# EAGLE design MAX5214 (EAGLE 6.5.0)

## Sheet 1 of 2

## Sheet 2 of 2
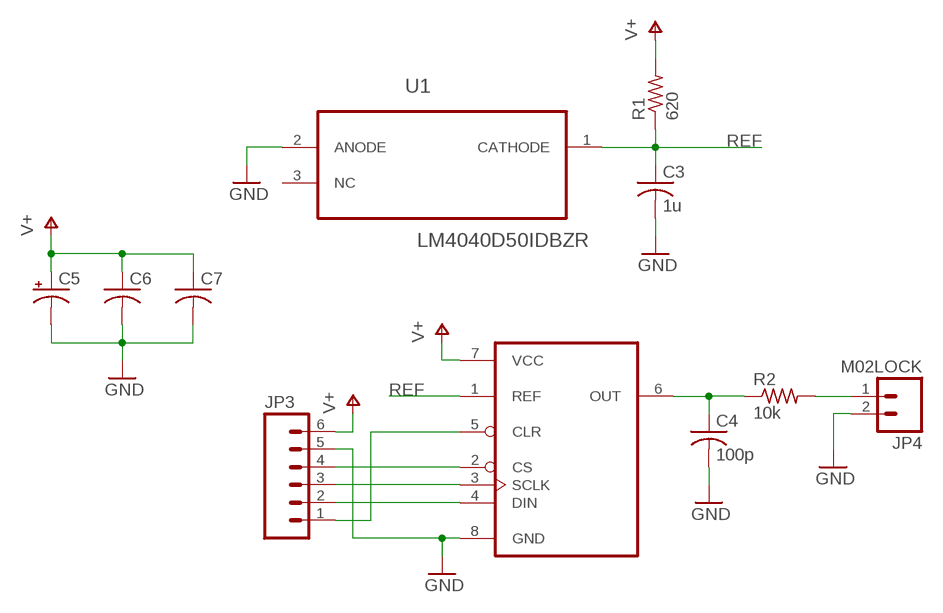
[diagram p0: schematic, sheet 2]

### Parts
C3  1u  C-USC0805  [C0805]
C4  100p  C-USC0805  [C0805]
C5  CPOL-US  [SMD_6.6X6.6]
C6  C-USC0805  [C0805]
C7  C-USC0805  [C0805]
JP3  M06LOCK  [1X06_LOCK]
JP4  M02LOCK  [1X02_LOCK]
R1  620  R-US_R0805  [R0805]
R2  10k  R-US_R0805  [R0805]
U1  LM4040D50IDBZR  [SOT95P237X112-3N]
U$2  MAX5214  [UMAX8]

### Nets
CLR: JP3.1 U$2.5(CLR)
CS: JP3.4 U$2.2(CS)
DIN: JP3.2 U$2.4(DIN)
GND: C3.2 C4.2 C5.- C6.2 C7.2 JP3.5 JP4.2 U1.2(ANODE) U$2.8(GND)
N$5: JP4.1 R2.2
N$6: C4.1 R2.1 U$2.6(OUT)
REF: C3.1 R1.1 U1.1(CATHODE) U$2.1(REF)
SCLK: JP3.3 U$2.3(SCLK)
V+: C5.+ C6.1 C7.1 JP3.6 R1.2 U$2.7(VCC)
Unconnected: U1.3(NC)

## Library data of the parts
C3 C4 C6 C7 = rcl:C-US: CAPACITOR, American symbol
C5 = rcl:CPOL-US: POLARIZED CAPACITOR, American symbol
JP3 = SparkFun-Connectors:M06: Header 6 Standard 6-pin 0.1" header. Use with straight break away headers (SKU : PRT-00116), right angle break away headers (PRT-00553), swiss pins (PRT-00743), machine pins (PRT-00117), and female headers (PRT-00115). Molex polarized connector foot print use with SKU : PRT-08094 with associated crimp pins and housings. NOTES ON THE VARIANTS LOCK and LOCK_LONGPADS... This footprint was designed to help hold the alignment of a through-hole component (i.e. 6-pin header) while soldering it into place. You may notice that each hole has been shifted either up or down by 0.005 of an inch from it's more standard position (which is a perfectly straight line). This slight alteration caused the pins (the squares in the middle) to touch the edges of the holes. Because they are alternating, it causes a "brace" to hold the component in place. 0.005 has proven to be the perfect amount of "off-center" position when using our standard breakaway headers. Although looks a little odd when you look at the bare footprint, once you have a header in there, the alteration is very hard to notice. Also,if you push a header all the way into place, it is covered up entirely on the bottom side. This idea of altering the position of holes to aid alignment will be further integrated into the Sparkfun Library for other footprints. It can help hold any component with 3 or more connection pins.
JP4 = SparkFun-Connectors:M02: Standard 2-pin 0.1" header. Use with - straight break away headers ( PRT-00116) - right angle break away headers (PRT-00553) - swiss pins (PRT-00743) - machine pins (PRT-00117) - female headers (PRT-00115) Molex polarized connector foot print use with: PRT-08233 with associated crimp pins and housings. 2.54_SCREWTERM for use with PRT-10571. 3.5mm Screw Terminal footprints for PRT-08084 5mm Screw Terminal footprints for use with PRT-08432
R1 R2 = rcl:R-US_: RESISTOR, American symbol
U1 = LM4040-5.0_SOIC:LM4040D50IDBZR: PRECISION MICROPOWER SHUNT VOLTAGE REFERENCE; MPN: LM4040D50IDBZR; OC_FARNELL: 1652239; OC_NEWARK: 43K3367; PACKAGE: 3-SOT-23; SUPPLIER: TEXAS INSTRUMENTS
U$2 = maxim:MAX5214

## Board
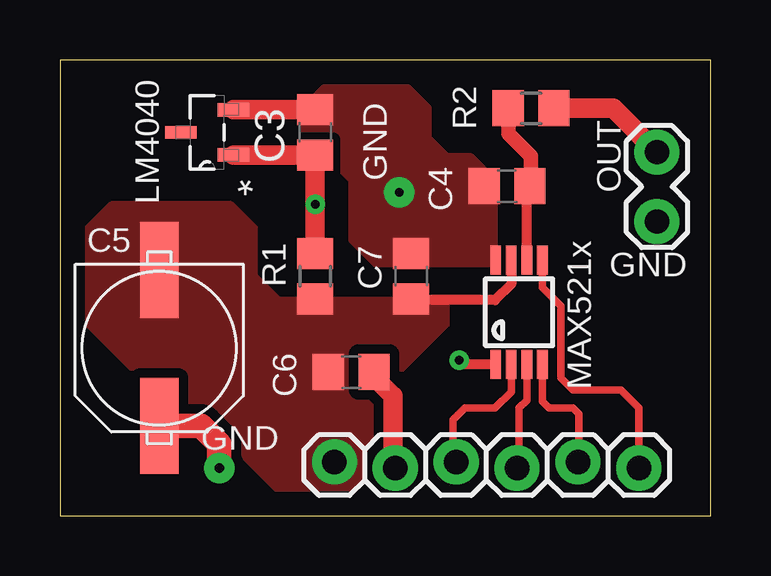
[diagram p1: board, top side]
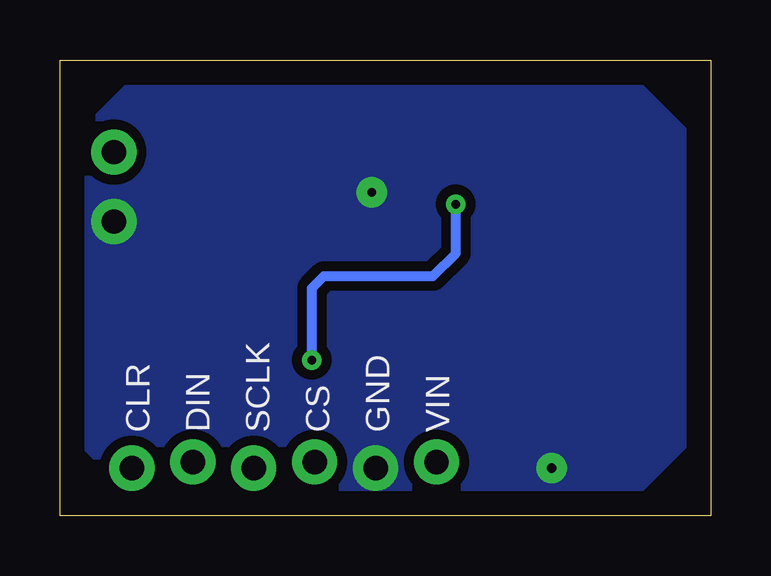
[diagram p2: board, bottom side, seen from below]

Size 27.14 x 19.02 mm. Coordinates in mm from the lower left corner, seen from the top.
Outline: 0,0 27.14,0 27.14,19.02 0,19.02 0,0
Copper layers (1*16): Top 0.035mm / dielectric 1.5mm / Bottom 0.035mm
Design rules "default": minimum track width 10mil, minimum drill 24mil, track to track 8mil, track to pad 8mil, pad to pad 8mil, via to via 8mil, smd to smd 8mil, copper to edge 40mil, drill to drill 8mil, minimum pad ring 10mil, minimum via ring 8mil, stop-mask expansion 4mil, vias tented up to drill 0mil, thermal gap 10mil

### Footprints (pad centres in the part's own frame; a part is rotated, then mirrored left to right if it is on the bottom)
C0805 = smd 1.3 x 1.5: 1 -0.95,0; 2 0.95,0
SMD_6.6X6.6 = smd 4 x 1.6: + -3.25,0; - 3.25,0
1X06_LOCK = drill 1.016 pad 1.88: 1 0,0; 2 2.54,-0.254; 3 5.08,0; 4 7.62,-0.254; 5 10.16,0; 6 12.7,-0.254
1X02_LOCK = drill 1.016 pad 1.88: 1 -0.178,0; 2 2.718,0
R0805 = smd 1.3 x 1.5: 1 -0.95,0; 2 0.95,0
SOT95P237X112-3N = smd 1.321 x 0.559: 1 -1.092,0.94; 2 -1.092,-0.94 | smd 1.321 x 0.508: 3 1.092,0
UMAX8 = smd 0.45 x 1.2: 1 -0.975,-2.175; 2 -0.325,-2.175; 3 0.325,-2.175; 4 0.975,-2.175; 5 0.975,2.175; 6 0.325,2.175; 7 -0.325,2.175; 8 -0.975,2.175

### Placement (x,y rotation side)
C3  10.64,16 90 top
C4  18.64,13.75 180 top
C5  4.14,7 270 top
C6  12.14,6 0 top
C7  14.64,10 90 top
JP3  24.14,2 180 top
JP4  24.89,15 270 top
R1  10.64,10 270 top
R2  19.64,17 0 top
U1  6.14,16 180 top
U$2  19.14,8.5 0 top

### Tracks (layer width: path | path; a pad name or v marks a point on that pad's centre or on a via)
CLR
  Top 0.305: U$2.5 20.12,9.52 20.89,8.75 20.89,5.75 21.39,5.25 23.39,5.25 24.14,4.5 JP3.1
CS
  Top 0.305: U$2.2 18.82,5.17 18.14,4.5 16.89,4.5 16.39,4 16.39,2.38 JP3.4
DIN
  Top 0.305: U$2.4 20.12,4.78 20.39,4.5 21.39,4.5 21.64,4.25 21.64,2.29 JP3.2
GND  (via drill 0.35 pad 1.27, 0.4 pad 1.27)
  Top 0.813: U1.2 C3.2 | C6.2 13.09,5.8 13.89,5 13.89,2.09 JP3.5
  Top 1.016: C5.- 5.89,3.75 6.64,3 v6.64,2
  other vias: 14.14,13.5
  pour Bottom (isolate 0.406, no thermals): 24.14,1 26.14,3 26.14,16 24.14,18 3.14,18 1.14,16 1.14,3 3.14,1
  pour Top (isolate 0.305, no thermals): 14.39,18 11.14,18 10.14,17 10.14,16 12.14,14 12.14,11.5 13.14,10.5 18.14,10.5 18.14,14 17.14,15 16.14,15 15.39,15.75 15.39,17
N$5
  Top 0.813: R2.2 23.07,17 JP4.1
N$6
  Top 0.406: U$2.6 19.46,13.62 C4.1
  Top 0.61: R2.1 18.69,15.95 19.64,15 19.64,13.8 C4.1
REF  (via drill 0.35 pad 0.81)
  Top 0.406: U$2.1 16.82,6.33 v16.64,6.5
  Top 0.813: U1.1 C3.1 v10.64,13 R1.1
  Bottom 0.406: v16.64,6.5 16.64,9.5 16.14,10 11.59,10 R1.1 v10.64,13
SCLK
  Top 0.305: U$2.3 19.46,4.83 19.14,4.5 19.14,2.08 JP3.3
V+
  Top 0.305: 15.19,9 C7.1
  Top 0.406: U$2.7 18.82,9.67 18.14,9 15.19,9
  pour Top (isolate 0.406, no thermals): 7.14,13 2.14,13 1.14,12 1.14,8 3.14,6 4.14,6 9.14,1 12.14,1 13.14,2 13.14,5 16.14,8 16.14,9 9.14,9 8.14,10 8.14,12

### Text on the board
tPlace: GND | OUT | LM4040 | MAX521x | C5 | GND | GND
bPlace: VIN | GND | CS | SCLK | DIN | CLR